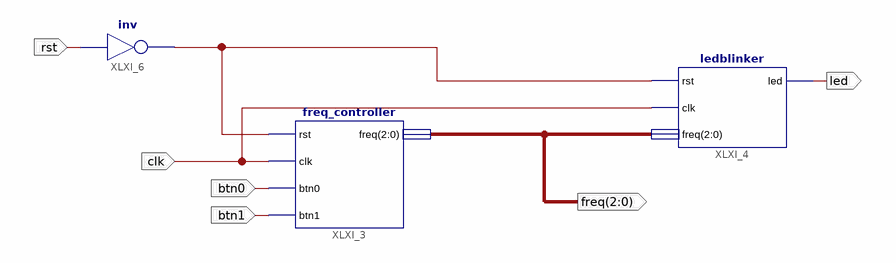
[diagram p0: schematic sheet 1]
// Xilinx ISE schematic whole_design_schema.sch (spartan6) as structural Verilog: 3 symbols, 6 ports
module whole_design_schema (
  input  clk,
  input  btn0,
  input  btn1,
  input  rst,
  output [2:0] freq,
  output led
);

  wire XLXN_26;

  freq_controller XLXI_3 (.rst(XLXN_26), .clk(clk), .btn0(btn0), .btn1(btn1), .freq(freq));
  ledblinker XLXI_4 (.rst(XLXN_26), .clk(clk), .freq(freq), .led(led));
  not XLXI_6 (XLXN_26, rst);
endmodule
